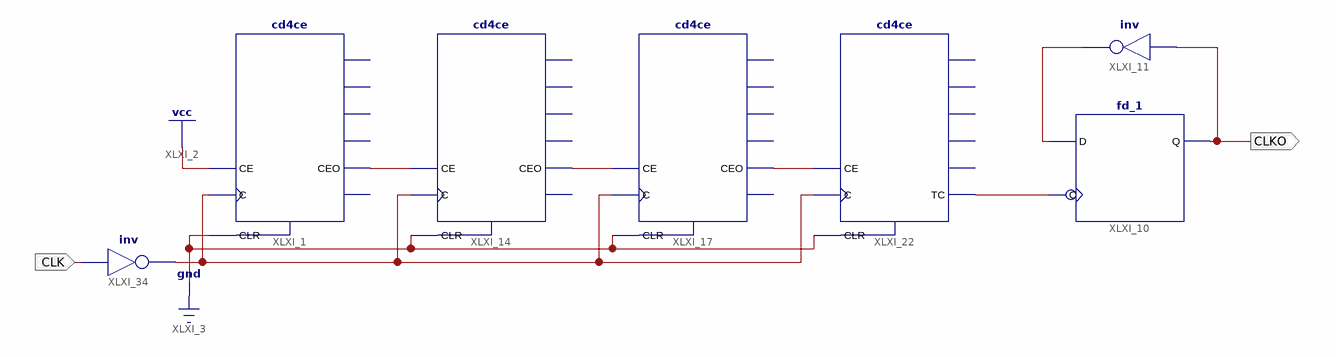
[diagram p0: schematic sheet 1]
// Xilinx ISE schematic clkdiv20k.sch (spartan6) as structural Verilog: 7 symbols, 2 ports
module clkdiv20k (
  input  CLK,
  output CLKO
);

  wire CLK_I, XLXN_11, XLXN_14, XLXN_27, XLXN_37, XLXN_41;

  cd4ce XLXI_1 (.C(CLK_I), .CE(1'b1), .CLR(1'b0), .CEO(XLXN_14));  // open: Q0, Q1, Q2, Q3, TC
  cd4ce XLXI_14 (.C(CLK_I), .CE(XLXN_14), .CLR(1'b0), .CEO(XLXN_27));  // open: Q0, Q1, Q2, Q3, TC
  cd4ce XLXI_17 (.C(CLK_I), .CE(XLXN_27), .CLR(1'b0), .CEO(XLXN_37));  // open: Q0, Q1, Q2, Q3, TC
  cd4ce XLXI_22 (.C(CLK_I), .CE(XLXN_37), .CLR(1'b0), .TC(XLXN_41));  // open: CEO, Q0, Q1, Q2, Q3
  fd_1 XLXI_10 (.C(XLXN_41), .D(XLXN_11), .Q(CLKO));
  not XLXI_11 (XLXN_11, CLKO);
  not XLXI_34 (CLK_I, CLK);
endmodule
